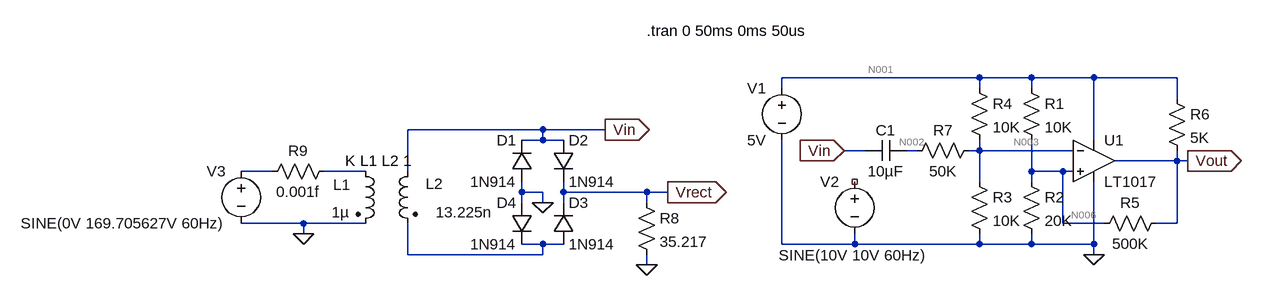
[diagram p0: schematic sine_to_square.asc]
sine_to_square.asc, the LTspice schematic file:
Version 4
SHEET 1 880 680
WIRE 0 -16 -304 -16
WIRE 80 -16 0 -16
WIRE 176 -16 80 -16
WIRE 304 -16 176 -16
WIRE -304 0 -304 -16
WIRE 0 0 0 -16
WIRE 80 0 80 -16
WIRE 304 16 304 -16
WIRE -672 64 -880 64
WIRE -576 64 -672 64
WIRE -672 80 -672 64
WIRE -672 80 -704 80
WIRE -640 80 -672 80
WIRE 176 80 176 -16
WIRE -176 96 -208 96
WIRE -96 96 -112 96
WIRE 0 96 0 80
WIRE 0 96 -16 96
WIRE 144 96 0 96
WIRE 304 112 304 96
WIRE 304 112 208 112
WIRE 320 112 304 112
WIRE -1088 128 -1136 128
WIRE -944 128 -1008 128
WIRE -880 128 -880 64
WIRE 80 128 80 80
WIRE 128 128 80 128
WIRE 144 128 128 128
WIRE 0 144 0 96
WIRE 80 144 80 128
WIRE -704 160 -704 144
WIRE -672 160 -704 160
WIRE -640 160 -640 144
WIRE -512 160 -640 160
WIRE -480 160 -512 160
WIRE -704 176 -704 160
WIRE -672 176 -672 160
WIRE -640 176 -640 160
WIRE -512 176 -512 160
WIRE -1040 208 -1136 208
WIRE -944 208 -1040 208
WIRE 128 208 128 128
WIRE 192 208 128 208
WIRE 304 208 304 112
WIRE 304 208 272 208
WIRE -1040 224 -1040 208
WIRE -672 240 -704 240
WIRE -640 240 -672 240
WIRE -304 240 -304 80
WIRE -192 240 -192 224
WIRE -192 240 -304 240
WIRE 0 240 0 224
WIRE 0 240 -192 240
WIRE 80 240 80 224
WIRE 80 240 0 240
WIRE 176 240 176 144
WIRE 176 240 80 240
WIRE -880 256 -880 208
WIRE -672 256 -672 240
WIRE -672 256 -880 256
WIRE 176 256 176 240
WIRE -512 272 -512 256
FLAG 176 256 0
FLAG 320 112 Vout
IOPIN 320 112 Out
FLAG -208 96 Vin
IOPIN -208 96 In
FLAG -1040 224 0
FLAG -672 176 0
FLAG -480 160 Vrect
IOPIN -480 160 Out
FLAG -512 272 0
FLAG -576 64 Vin
IOPIN -576 64 Out
SYMBOL Comparators\\LT1017 176 112 R0
SYMATTR InstName U1
SYMBOL res 64 -16 R0
SYMATTR InstName R1
SYMATTR Value 10K
SYMBOL res 64 128 R0
SYMATTR InstName R2
SYMATTR Value 20K
SYMBOL res -16 128 R0
SYMATTR InstName R3
SYMATTR Value 10K
SYMBOL res -16 -16 R0
SYMATTR InstName R4
SYMATTR Value 10K
SYMBOL res 288 192 R90
WINDOW 0 0 56 VBottom 2
WINDOW 3 32 56 VTop 2
SYMATTR InstName R5
SYMATTR Value 500K
SYMBOL res 0 80 R90
WINDOW 0 0 56 VBottom 2
WINDOW 3 32 56 VTop 2
SYMATTR InstName R7
SYMATTR Value 50K
SYMBOL cap -112 80 R90
WINDOW 0 0 32 VBottom 2
WINDOW 3 32 32 VTop 2
SYMATTR InstName C1
SYMATTR Value 10µF
SYMBOL voltage -304 -16 M0
WINDOW 123 0 0 Left 2
WINDOW 39 0 0 Left 2
SYMATTR InstName V1
SYMATTR Value 5V
SYMBOL voltage -192 128 M0
WINDOW 123 0 0 Left 2
WINDOW 39 0 0 Left 2
WINDOW 3 -110 129 Left 2
SYMATTR Value SINE(10V 10V 60Hz)
SYMATTR InstName V2
SYMBOL res 288 0 R0
SYMATTR InstName R6
SYMATTR Value 5K
SYMBOL ind2 -960 112 R0
WINDOW 0 -34 37 Left 2
WINDOW 3 -37 79 Left 2
SYMATTR InstName L1
SYMATTR Value 1µ
SYMATTR Type ind
SYMBOL ind2 -864 112 M0
WINDOW 0 -39 35 Left 2
WINDOW 3 -115 79 Left 2
SYMATTR InstName L2
SYMATTR Value 13.225n
SYMATTR Type ind
SYMBOL voltage -1136 112 M0
WINDOW 123 0 0 Left 2
WINDOW 39 0 0 Left 2
SYMATTR InstName V3
SYMATTR Value SINE(0V 169.705627V 60Hz)
SYMBOL res -992 112 R90
WINDOW 0 0 56 VBottom 2
WINDOW 3 32 56 VTop 2
SYMATTR InstName R9
SYMATTR Value 0.001f
SYMBOL diode -688 144 R180
WINDOW 0 24 64 Left 2
WINDOW 3 24 0 Left 2
SYMATTR InstName D1
SYMATTR Value 1N914
SYMBOL diode -656 80 R0
SYMATTR InstName D2
SYMATTR Value 1N914
SYMBOL diode -656 240 M180
WINDOW 0 24 64 Left 2
WINDOW 3 24 0 Left 2
SYMATTR InstName D3
SYMATTR Value 1N914
SYMBOL diode -688 176 M0
SYMATTR InstName D4
SYMATTR Value 1N914
SYMBOL res -528 160 R0
SYMATTR InstName R8
SYMATTR Value 35.217
TEXT -512 -88 Left 2 !.tran 0 50ms 0ms 50us
TEXT -976 112 Left 2 !K L1 L2 1

The netlist it stands for:
* sine_to_square.asc
XU1 N006 N003 N001 0 Vout LT1017  ; pins In+ In- V+ V- OUT
R1 N001 N006 10K
R2 N006 0 20K
R3 N003 0 10K
R4 N001 N003 10K
R5 Vout N006 500K
R7 N003 N002 50K
C1 N002 Vin 10µF
V1 N001 0 5V
V2 NC_01 0 SINE(10V 10V 60Hz)
R6 N001 Vout 5K
L1 N005 0 1µ
L2 Vin N007 13.225n
V3 N004 0 SINE(0V 169.705627V 60Hz)
R9 N005 N004 0.001f
D1 0 Vin 1N914
D2 Vin Vrect 1N914
D3 N007 Vrect 1N914
D4 0 N007 1N914
R8 Vrect 0 35.217
.model D D
.lib standard.dio
.tran 0 50ms 0ms 50us
K L1 L2 1
.backanno
.end

* Results of the author's LTspice run, read from the files saved beside the schematic
* Operating Point, zero values left out:
*   V(n001) = 5 V
*   V(vout) = 4.969 V
*   V(n003) = 2.5 V
*   V(n006) = 3.355 V
*   V(n002) = 2.5 V
*   I(R6) = 6.111 µA
*   I(R5) = 3.229 µA
*   I(R4) = 250 µA
*   I(R3) = 250 µA
*   I(R2) = 167.7 µA
*   I(R1) = 164.5 µA
*   I(V1) = -539.3 µA
*   Ix(u1:1) = 6.104 nA
*   Ix(u1:2) = 101.6 pA
*   Ix(u1:3) = 118.6 µA
*   Ix(u1:4) = -121.5 µA
*   Ix(u1:5) = 2.882 µA
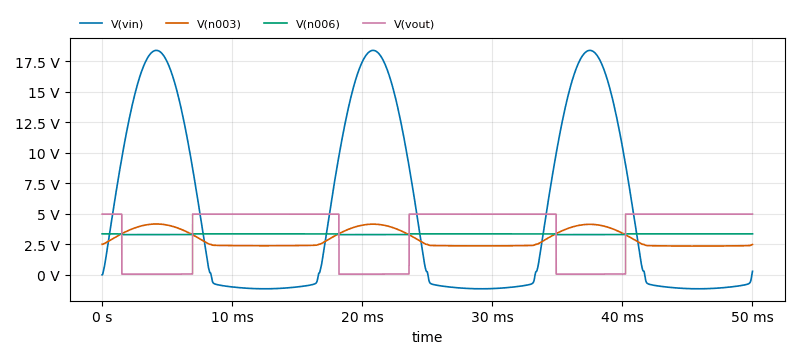
[diagram p1: Transient Analysis of sine_to_square.asc, plotted from the saved traces]
* Transient Analysis, 1 run:
*   V(vin): min -1.143 V, max 18.37 V, average 5.234 V, rms 9.112 V, last 288.9 mV
*   V(n003): min 2.354 V, max 4.162 V, average 2.951 V, rms 3.028 V, last 2.485 V
*   V(n006): min 3.29 V, max 3.355 V, average 3.334 V, rms 3.334 V, last 3.355 V
*   V(vout): min 59.22 mV, max 4.969 V, average 3.381 V, rms 4.088 V, last 4.969 V